# Altium schematic sheet FPGABanks.SchDoc: FPGA - Banks
size A3; Organization: Altium Limited; Address1: L3, 12a Rodborough Rd; Address2: Frenchs Forest; Address3: NSW; Address4: Australia 2086; DocumentNumber: 6; Revision: 1.0; SheetNumber: 6; SheetTotal: 8; SheetSize: A3
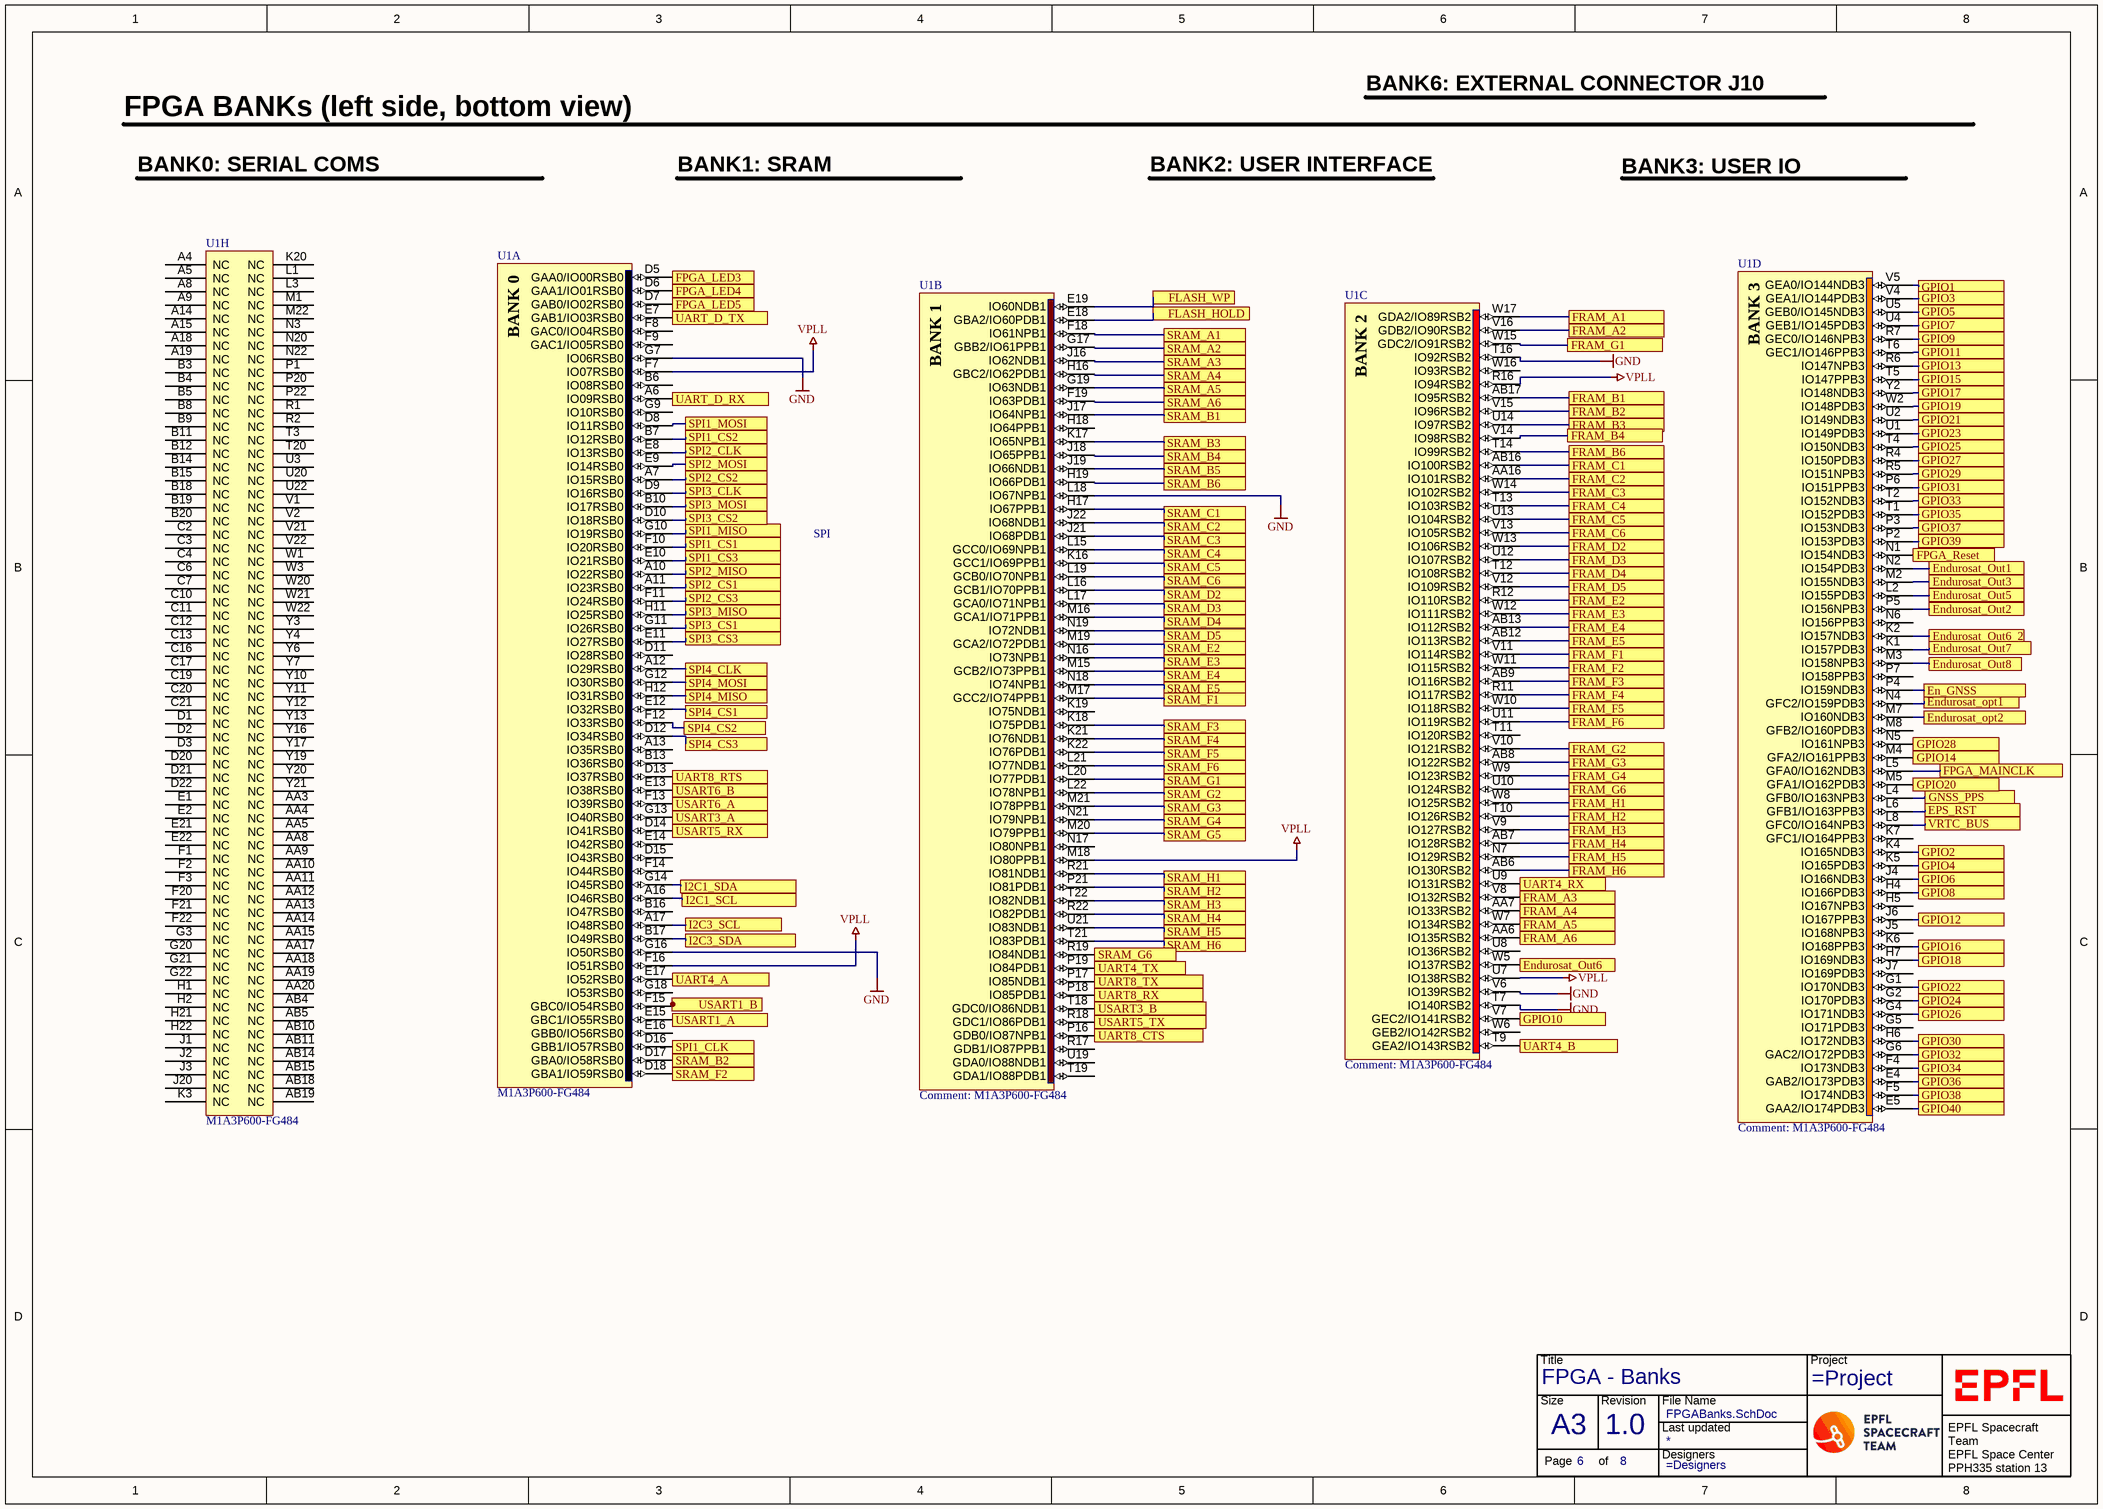
[diagram p0: FPGABanks.SchDoc]

## Parts
*  TitleBlock  (value not drawn)  (graphical)
U1  M1A3P600-FG484  [FG484]  (parts A,B,C,D,H of 8)

## Ports
En_GNSS, Endurosat_opt1, Endurosat_opt2, Endurosat_Out1, Endurosat_Out2, Endurosat_Out3, Endurosat_Out5, Endurosat_Out6, Endurosat_Out6_2, Endurosat_Out7, Endurosat_Out8, EPS_RST, FLASH_HOLD, FLASH_WP, FPGA_LED3, FPGA_LED4, FPGA_LED5, FPGA_MAINCLK, FPGA_Reset, FRAM_A1, FRAM_A2, FRAM_A3, FRAM_A4, FRAM_A5, FRAM_A6, FRAM_B1, FRAM_B2, FRAM_B3, FRAM_B4, FRAM_B6, FRAM_C1, FRAM_C2, FRAM_C3, FRAM_C4, FRAM_C5, FRAM_C6, FRAM_D2, FRAM_D3, FRAM_D4, FRAM_D5, FRAM_E2, FRAM_E3, FRAM_E4, FRAM_E5, FRAM_F1, FRAM_F2, FRAM_F3, FRAM_F4, FRAM_F5, FRAM_F6, FRAM_G1, FRAM_G2, FRAM_G3, FRAM_G4, FRAM_G6, FRAM_H1, FRAM_H2, FRAM_H3, FRAM_H4, FRAM_H5, FRAM_H6, GNSS_PPS, GPIO1, GPIO2, GPIO3, GPIO4, GPIO5, GPIO6, GPIO7, GPIO8, GPIO9, GPIO10, GPIO11, GPIO12, GPIO13, GPIO14, GPIO15, GPIO16, GPIO17, GPIO18, GPIO19, GPIO20, GPIO21, GPIO22, GPIO23, GPIO24, GPIO25, GPIO26, GPIO27, GPIO28, GPIO29, GPIO30, GPIO31, GPIO32, GPIO33, GPIO34, GPIO35, GPIO36, GPIO37, GPIO38, GPIO39, GPIO40, I2C1_SCL, I2C1_SDA, I2C3_SCL, I2C3_SDA, SPI1_CLK, SPI1_CS1, SPI1_CS2, SPI1_CS3, SPI1_MISO, SPI1_MOSI, SPI2_CLK, SPI2_CS1, SPI2_CS2, SPI2_CS3, SPI2_MISO, SPI2_MOSI, SPI3_CLK, SPI3_CS1, SPI3_CS2, SPI3_CS3, SPI3_MISO, SPI3_MOSI, SPI4_CLK, SPI4_CS1, SPI4_CS2, SPI4_CS3, SPI4_MISO, SPI4_MOSI, SRAM_A1, SRAM_A2, SRAM_A3, SRAM_A4, SRAM_A5, SRAM_A6, SRAM_B1, SRAM_B2, SRAM_B3, SRAM_B4, SRAM_B5, SRAM_B6, SRAM_C1, SRAM_C2, SRAM_C3, SRAM_C4, SRAM_C5, SRAM_C6, SRAM_D2, SRAM_D3, SRAM_D4, SRAM_D5, SRAM_E2, SRAM_E3, SRAM_E4, SRAM_E5, SRAM_F1, SRAM_F2, SRAM_F3, SRAM_F4, SRAM_F5, SRAM_F6, SRAM_G1, SRAM_G2, SRAM_G3, SRAM_G4, SRAM_G5, SRAM_G6, SRAM_H1, SRAM_H2, SRAM_H3, SRAM_H4, SRAM_H5, SRAM_H6, UART4_A, UART4_B, UART4_RX, UART4_TX, UART8_CTS, UART8_RTS, UART8_RX, UART8_TX, UART_D_RX, UART_D_TX, USART1_A, USART1_B, USART3_A, USART3_B, USART5_RX, USART5_TX, USART6_A, USART6_B, VRTC_BUS

## Nets
GND: U1.G7(IO06RSB0) U1.G16(IO50RSB0) U1.L18(IO67NPB1) U1.T7(IO140RSB2) U1.T16(IO92RSB2) U1.V6(IO139RSB2)
VPLL: U1.F7(IO07RSB0) U1.F16(IO51RSB0) U1.M18(IO80PPB1) U1.R16(IO94RSB2) U1.U7(IO138RSB2)
En_GNSS: U1.P4(IO159NDB3) ; port En_GNSS
Endurosat_opt1: U1.N4(GFC2/IO159PDB3) ; port Endurosat_opt1
Endurosat_opt2: U1.M7(IO160NDB3) ; port Endurosat_opt2
Endurosat_Out1: U1.N2(IO154PDB3) ; port Endurosat_Out1
Endurosat_Out2: U1.P5(IO156NPB3) ; port Endurosat_Out2
Endurosat_Out3: U1.M2(IO155NDB3) ; port Endurosat_Out3
Endurosat_Out5: U1.L2(IO155PDB3) ; port Endurosat_Out5
Endurosat_Out6: U1.W5(IO137RSB2) ; port Endurosat_Out6
Endurosat_Out6_2: U1.K2(IO157NDB3) ; port Endurosat_Out6_2
Endurosat_Out7: U1.K1(IO157PDB3) ; port Endurosat_Out7
Endurosat_Out8: U1.M3(IO158NPB3) ; port Endurosat_Out8
EPS_RST: U1.L6(GFB1/IO163PPB3) ; port EPS_RST
FLASH_HOLD: U1.E18(GBA2/IO60PDB1) ; port FLASH_HOLD
FLASH_WP: U1.E19(IO60NDB1) ; port FLASH_WP
FPGA_LED3: U1.D5(GAA0/IO00RSB0) ; port FPGA_LED3
FPGA_LED4: U1.D6(GAA1/IO01RSB0) ; port FPGA_LED4
FPGA_LED5: U1.D7(GAB0/IO02RSB0) ; port FPGA_LED5
FPGA_MAINCLK: U1.L5(GFA0/IO162NDB3) ; port FPGA_MAINCLK
FPGA_Reset: U1.N1(IO154NDB3) ; port FPGA_Reset
FRAM_A1: U1.W17(GDA2/IO89RSB2) ; port FRAM_A1
FRAM_A2: U1.V16(GDB2/IO90RSB2) ; port FRAM_A2
FRAM_A3: U1.V8(IO132RSB2) ; port FRAM_A3
FRAM_A4: U1.AA7(IO133RSB2) ; port FRAM_A4
FRAM_A5: U1.W7(IO134RSB2) ; port FRAM_A5
FRAM_A6: U1.AA6(IO135RSB2) ; port FRAM_A6
FRAM_B1: U1.AB17(IO95RSB2) ; port FRAM_B1
FRAM_B2: U1.V15(IO96RSB2) ; port FRAM_B2
FRAM_B3: U1.U14(IO97RSB2) ; port FRAM_B3
FRAM_B4: U1.V14(IO98RSB2) ; port FRAM_B4
FRAM_B6: U1.T14(IO99RSB2) ; port FRAM_B6
FRAM_C1: U1.AB16(IO100RSB2) ; port FRAM_C1
FRAM_C2: U1.AA16(IO101RSB2) ; port FRAM_C2
FRAM_C3: U1.W14(IO102RSB2) ; port FRAM_C3
FRAM_C4: U1.T13(IO103RSB2) ; port FRAM_C4
FRAM_C5: U1.U13(IO104RSB2) ; port FRAM_C5
FRAM_C6: U1.V13(IO105RSB2) ; port FRAM_C6
FRAM_D2: U1.W13(IO106RSB2) ; port FRAM_D2
FRAM_D3: U1.U12(IO107RSB2) ; port FRAM_D3
FRAM_D4: U1.T12(IO108RSB2) ; port FRAM_D4
FRAM_D5: U1.V12(IO109RSB2) ; port FRAM_D5
FRAM_E2: U1.R12(IO110RSB2) ; port FRAM_E2
FRAM_E3: U1.W12(IO111RSB2) ; port FRAM_E3
FRAM_E4: U1.AB13(IO112RSB2) ; port FRAM_E4
FRAM_E5: U1.AB12(IO113RSB2) ; port FRAM_E5
FRAM_F1: U1.V11(IO114RSB2) ; port FRAM_F1
FRAM_F2: U1.W11(IO115RSB2) ; port FRAM_F2
FRAM_F3: U1.AB9(IO116RSB2) ; port FRAM_F3
FRAM_F4: U1.R11(IO117RSB2) ; port FRAM_F4
FRAM_F5: U1.W10(IO118RSB2) ; port FRAM_F5
FRAM_F6: U1.U11(IO119RSB2) ; port FRAM_F6
FRAM_G1: U1.W15(GDC2/IO91RSB2) ; port FRAM_G1
FRAM_G2: U1.V10(IO121RSB2) ; port FRAM_G2
FRAM_G3: U1.AB8(IO122RSB2) ; port FRAM_G3
FRAM_G4: U1.W9(IO123RSB2) ; port FRAM_G4
FRAM_G6: U1.U10(IO124RSB2) ; port FRAM_G6
FRAM_H1: U1.W8(IO125RSB2) ; port FRAM_H1
FRAM_H2: U1.T10(IO126RSB2) ; port FRAM_H2
FRAM_H3: U1.V9(IO127RSB2) ; port FRAM_H3
FRAM_H4: U1.AB7(IO128RSB2) ; port FRAM_H4
FRAM_H5: U1.N7(IO129RSB2) ; port FRAM_H5
FRAM_H6: U1.AB6(IO130RSB2) ; port FRAM_H6
GNSS_PPS: U1.L4(GFB0/IO163NPB3) ; port GNSS_PPS
GPIO1: U1.V5(GEA0/IO144NDB3) ; port GPIO1
GPIO2: U1.K4(IO165NDB3) ; port GPIO2
GPIO3: U1.V4(GEA1/IO144PDB3) ; port GPIO3
GPIO4: U1.K5(IO165PDB3) ; port GPIO4
GPIO5: U1.U5(GEB0/IO145NDB3) ; port GPIO5
GPIO6: U1.J4(IO166NDB3) ; port GPIO6
GPIO7: U1.U4(GEB1/IO145PDB3) ; port GPIO7
GPIO8: U1.H4(IO166PDB3) ; port GPIO8
GPIO9: U1.R7(GEC0/IO146NPB3) ; port GPIO9
GPIO10: U1.V7(GEC2/IO141RSB2) ; port GPIO10
GPIO11: U1.T6(GEC1/IO146PPB3) ; port GPIO11
GPIO12: U1.J6(IO167PPB3) ; port GPIO12
GPIO13: U1.R6(IO147NPB3) ; port GPIO13
GPIO14: U1.M4(GFA2/IO161PPB3) ; port GPIO14
GPIO15: U1.T5(IO147PPB3) ; port GPIO15
GPIO16: U1.K6(IO168PPB3) ; port GPIO16
GPIO17: U1.Y2(IO148NDB3) ; port GPIO17
GPIO18: U1.H7(IO169NDB3) ; port GPIO18
GPIO19: U1.W2(IO148PDB3) ; port GPIO19
GPIO20: U1.M5(GFA1/IO162PDB3) ; port GPIO20
GPIO21: U1.U2(IO149NDB3) ; port GPIO21
GPIO22: U1.G1(IO170NDB3) ; port GPIO22
GPIO23: U1.U1(IO149PDB3) ; port GPIO23
GPIO24: U1.G2(IO170PDB3) ; port GPIO24
GPIO25: U1.T4(IO150NDB3) ; port GPIO25
GPIO26: U1.G4(IO171NDB3) ; port GPIO26
GPIO27: U1.R4(IO150PDB3) ; port GPIO27
GPIO28: U1.N5(IO161NPB3) ; port GPIO28
GPIO29: U1.R5(IO151NPB3) ; port GPIO29
GPIO30: U1.H6(IO172NDB3) ; port GPIO30
GPIO31: U1.P6(IO151PPB3) ; port GPIO31
GPIO32: U1.G6(GAC2/IO172PDB3) ; port GPIO32
GPIO33: U1.T2(IO152NDB3) ; port GPIO33
GPIO34: U1.F4(IO173NDB3) ; port GPIO34
GPIO35: U1.T1(IO152PDB3) ; port GPIO35
GPIO36: U1.E4(GAB2/IO173PDB3) ; port GPIO36
GPIO37: U1.P3(IO153NDB3) ; port GPIO37
GPIO38: U1.F5(IO174NDB3) ; port GPIO38
GPIO39: U1.P2(IO153PDB3) ; port GPIO39
GPIO40: U1.E5(GAA2/IO174PDB3) ; port GPIO40
I2C1_SCL: U1.A16(IO46RSB0) ; port I2C1_SCL
I2C1_SDA: U1.G14(IO45RSB0) ; port I2C1_SDA
I2C3_SCL: U1.A17(IO48RSB0) ; port I2C3_SCL
I2C3_SDA: U1.B17(IO49RSB0) ; port I2C3_SDA
SPI1_CLK: U1.D16(GBB1/IO57RSB0) ; port SPI1_CLK
SPI1_CS1: U1.F10(IO20RSB0) ; port SPI1_CS1
SPI1_CS2: U1.B7(IO12RSB0) ; port SPI1_CS2
SPI1_CS3: U1.E10(IO21RSB0) ; port SPI1_CS3
SPI1_MISO: U1.G10(IO19RSB0) ; port SPI1_MISO
SPI1_MOSI: U1.D8(IO11RSB0) ; port SPI1_MOSI
SPI2_CLK: U1.E8(IO13RSB0) ; port SPI2_CLK
SPI2_CS1: U1.A11(IO23RSB0) ; port SPI2_CS1
SPI2_CS2: U1.A7(IO15RSB0) ; port SPI2_CS2
SPI2_CS3: U1.F11(IO24RSB0) ; port SPI2_CS3
SPI2_MISO: U1.A10(IO22RSB0) ; port SPI2_MISO
SPI2_MOSI: U1.E9(IO14RSB0) ; port SPI2_MOSI
SPI3_CLK: U1.D9(IO16RSB0) ; port SPI3_CLK
SPI3_CS1: U1.G11(IO26RSB0) ; port SPI3_CS1
SPI3_CS2: U1.D10(IO18RSB0) ; port SPI3_CS2
SPI3_CS3: U1.E11(IO27RSB0) ; port SPI3_CS3
SPI3_MISO: U1.H11(IO25RSB0) ; port SPI3_MISO
SPI3_MOSI: U1.B10(IO17RSB0) ; port SPI3_MOSI
SPI4_CLK: U1.A12(IO29RSB0) ; port SPI4_CLK
SPI4_CS1: U1.E12(IO32RSB0) ; port SPI4_CS1
SPI4_CS2: U1.F12(IO33RSB0) ; port SPI4_CS2
SPI4_CS3: U1.D12(IO34RSB0) ; port SPI4_CS3
SPI4_MISO: U1.H12(IO31RSB0) ; port SPI4_MISO
SPI4_MOSI: U1.G12(IO30RSB0) ; port SPI4_MOSI
SRAM_A1: U1.F18(IO61NPB1) ; port SRAM_A1
SRAM_A2: U1.G17(GBB2/IO61PPB1) ; port SRAM_A2
SRAM_A3: U1.J16(IO62NDB1) ; port SRAM_A3
SRAM_A4: U1.H16(GBC2/IO62PDB1) ; port SRAM_A4
SRAM_A5: U1.G19(IO63NDB1) ; port SRAM_A5
SRAM_A6: U1.F19(IO63PDB1) ; port SRAM_A6
SRAM_B1: U1.J17(IO64NPB1) ; port SRAM_B1
SRAM_B2: U1.D17(GBA0/IO58RSB0) ; port SRAM_B2
SRAM_B3: U1.K17(IO65NPB1) ; port SRAM_B3
SRAM_B4: U1.J18(IO65PPB1) ; port SRAM_B4
SRAM_B5: U1.J19(IO66NDB1) ; port SRAM_B5
SRAM_B6: U1.H19(IO66PDB1) ; port SRAM_B6
SRAM_C1: U1.H17(IO67PPB1) ; port SRAM_C1
SRAM_C2: U1.J22(IO68NDB1) ; port SRAM_C2
SRAM_C3: U1.J21(IO68PDB1) ; port SRAM_C3
SRAM_C4: U1.L15(GCC0/IO69NPB1) ; port SRAM_C4
SRAM_C5: U1.K16(GCC1/IO69PPB1) ; port SRAM_C5
SRAM_C6: U1.L19(GCB0/IO70NPB1) ; port SRAM_C6
SRAM_D2: U1.L16(GCB1/IO70PPB1) ; port SRAM_D2
SRAM_D3: U1.L17(GCA0/IO71NPB1) ; port SRAM_D3
SRAM_D4: U1.M16(GCA1/IO71PPB1) ; port SRAM_D4
SRAM_D5: U1.N19(IO72NDB1) ; port SRAM_D5
SRAM_E2: U1.M19(GCA2/IO72PDB1) ; port SRAM_E2
SRAM_E3: U1.N16(IO73NPB1) ; port SRAM_E3
SRAM_E4: U1.M15(GCB2/IO73PPB1) ; port SRAM_E4
SRAM_E5: U1.N18(IO74NPB1) ; port SRAM_E5
SRAM_F1: U1.M17(GCC2/IO74PPB1) ; port SRAM_F1
SRAM_F2: U1.D18(GBA1/IO59RSB0) ; port SRAM_F2
SRAM_F3: U1.K18(IO75PDB1) ; port SRAM_F3
SRAM_F4: U1.K21(IO76NDB1) ; port SRAM_F4
SRAM_F5: U1.K22(IO76PDB1) ; port SRAM_F5
SRAM_F6: U1.L21(IO77NDB1) ; port SRAM_F6
SRAM_G1: U1.L20(IO77PDB1) ; port SRAM_G1
SRAM_G2: U1.L22(IO78NPB1) ; port SRAM_G2
SRAM_G3: U1.M21(IO78PPB1) ; port SRAM_G3
SRAM_G4: U1.N21(IO79NPB1) ; port SRAM_G4
SRAM_G5: U1.M20(IO79PPB1) ; port SRAM_G5
SRAM_G6: U1.R19(IO84NDB1) ; port SRAM_G6
SRAM_H1: U1.R21(IO81NDB1) ; port SRAM_H1
SRAM_H2: U1.P21(IO81PDB1) ; port SRAM_H2
SRAM_H3: U1.T22(IO82NDB1) ; port SRAM_H3
SRAM_H4: U1.R22(IO82PDB1) ; port SRAM_H4
SRAM_H5: U1.U21(IO83NDB1) ; port SRAM_H5
SRAM_H6: U1.T21(IO83PDB1) ; port SRAM_H6
UART4_A: U1.E17(IO52RSB0) ; port UART4_A
UART4_B: U1.T9(GEA2/IO143RSB2) ; port UART4_B
UART4_RX: U1.U9(IO131RSB2) ; port UART4_RX
UART4_TX: U1.P19(IO84PDB1) ; port UART4_TX
UART8_CTS: U1.P16(GDB0/IO87NPB1) ; port UART8_CTS
UART8_RTS: U1.D13(IO37RSB0) ; port UART8_RTS
UART8_RX: U1.P18(IO85PDB1) ; port UART8_RX
UART8_TX: U1.P17(IO85NDB1) ; port UART8_TX
UART_D_RX: U1.A6(IO09RSB0) ; port UART_D_RX
UART_D_TX: U1.E7(GAB1/IO03RSB0) ; port UART_D_TX
USART1_A: U1.E15(GBC1/IO55RSB0) ; port USART1_A
USART1_B: U1.F15(GBC0/IO54RSB0) ; port USART1_B
USART3_A: U1.G13(IO40RSB0) ; port USART3_A
USART3_B: U1.T18(GDC0/IO86NDB1) ; port USART3_B
USART5_RX: U1.D14(IO41RSB0) ; port USART5_RX
USART5_TX: U1.R18(GDC1/IO86PDB1) ; port USART5_TX
USART6_A: U1.F13(IO39RSB0) ; port USART6_A
USART6_B: U1.E13(IO38RSB0) ; port USART6_B
VRTC_BUS: U1.L8(GFC0/IO164NPB3) ; port VRTC_BUS

Not connected (* = marked no-connect by the designer): U1 A4(NC) A5(NC) A8(NC) A9(NC) A13(IO35RSB0) A14(NC) A15(NC) A18(NC) A19(NC) AA3(NC) AA4(NC) AA5(NC) AA8(NC) AA9(NC) AA10(NC) AA11(NC) AA12(NC) AA13(NC) AA14(NC) AA15(NC) AA17(NC) AA18(NC) AA19(NC) AA20(NC) AB4(NC) AB5(NC) AB10(NC) AB11(NC) AB14(NC) AB15(NC) AB18(NC) AB19(NC) B3(NC) B4(NC) B5(NC) B6(IO08RSB0) B8(NC) B9(NC) B11(NC) B12(NC) B13(IO36RSB0) B14(NC) B15(NC) B16(IO47RSB0) B18(NC) B19(NC) B20(NC) C2(NC) C3(NC) C4(NC) C6(NC) C7(NC) C10(NC) C11(NC) C12(NC) C13(NC) C16(NC) C17(NC) C19(NC) C20(NC) C21(NC) D1(NC) D2(NC) D3(NC) D11(IO28RSB0) D15(IO43RSB0) D20(NC) D21(NC) D22(NC) E1(NC) E2(NC) E14(IO42RSB0) E16(GBB0/IO56RSB0) E21(NC) E22(NC) F1(NC) F2(NC) F3(NC) F8(GAC0/IO04RSB0) F9(GAC1/IO05RSB0) F14(IO44RSB0) F20(NC) F21(NC) F22(NC) G3(NC) G5(IO171PDB3) G9(IO10RSB0) G18(IO53RSB0) G20(NC) G21(NC) G22(NC) H1(NC) H2(NC) H5(IO167NPB3) H18(IO64PPB1) H21(NC) H22(NC) J1(NC) J2(NC) J3(NC) J5(IO168NPB3) J7(IO169PDB3) J20(NC) K3(NC) K7(GFC1/IO164PPB3) K19(IO75NDB1) K20(NC) L1(NC) L3(NC) M1(NC) M8(GFB2/IO160PDB3) M22(NC) N3(NC) N6(IO156PPB3) N17(IO80NPB1) N20(NC) N22(NC) P1(NC) P7(IO158PPB3) P20(NC) P22(NC) R1(NC) R2(NC) R17(GDB1/IO87PPB1) T3(NC) T11(IO120RSB2) T19(GDA1/IO88PDB1) T20(NC) U3(NC) U8(IO136RSB2) U19(GDA0/IO88NDB1) U20(NC) U22(NC) V1(NC) V2(NC) V21(NC) V22(NC) W1(NC) W3(NC) W6(GEB2/IO142RSB2) W16(IO93RSB2) W20(NC) W21(NC) W22(NC) Y3(NC) Y4(NC) Y6(NC) Y7(NC) Y10(NC) Y11(NC) Y12(NC) Y13(NC) Y16(NC) Y17(NC) Y19(NC) Y20(NC) Y21(NC)

## Notes on the sheet
- BANK6: EXTERNAL CONNECTOR J10
- FPGA BANKs (left side, bottom view)
- BANK0: SERIAL COMS
- BANK1: SRAM
- BANK2: USER INTERFACE
- BANK3: USER IO
- SPI
- 8
- 7
- 6
- 5
- 4
- 3
- DWG. NO.
- REV.
- SHT.
- REVISION
- 2
- DESCRIPTION
- DATE
- 1
- APPROVED
- THIS DOCUMENT AND THE DATA DISCLOSED HEREIN OR HEREWITH IS THE PROPERTY OF ALTIUM LIMITED AND MAY BE FREELY DISTRIBUTED IN WHOLE. NO RIGHTS ARE RESERVED OR EXPRESS OR IMPLIED WARANTEE GIVEN.
- F
- E
- D
- C
- B
- ENG:
- APPROVALS
- PROJECT
- A
- DSN:
- CHK:
- REFERENCE DOCUMENTS
- PROJECT REVISION:
- TITLE
- DOCUMENT REVISION:
- DESIGN ITEM:
- BOM:
- FAB DWG:
- PCB DWG:
- ASSY DWG:
- SCALE:
- A3
- SIZE
- CAGE CODE
- FILE NAME
- DWG NO.
- SHEET
- OF
- REV
- (in symbol CMP-0097-00007-1, part A) BANK 0
- (in symbol CMP-0097-00007-1, part B) BANK 1
- (in symbol CMP-0097-00007-1, part C) BANK 2
- (in symbol CMP-0097-00007-1, part D) BANK 3
- (in symbol TitleBlock) Title; Project; Size; Revision; File Name; Last updated; Designers; Page; of; EPFL Spacecraft Team / EPFL Space Center / PPH335 station 13 / CH-1015 Lausanne

## Library data of the parts
* = TitleBlock: Title Block with generall information
U1 = CMP-0097-00007-1: M1-Ready ProASIC3 Flash Family FPGA, 235 User IOs, 600K System Gates, 108 Kbits RAM, 1 Kbit Flash ROM, 1 PLL, 484-Ball FBGA, Commercial Grade; Code_JEDEC: MS-034-AAJ-1; PackageDescription: 484-Ball Fine Pitch Plastic Ball Grid Array (FG484) - Fully Populated; DatasheetVersion: v1.3, Oct-2009; PackageReference: FG484; PackageVersion: ver11.2, Nov-2009; Code_IPC: BGA100P22X22-484